# EAGLE schematic DCFilter (EAGLE 7.3.0)
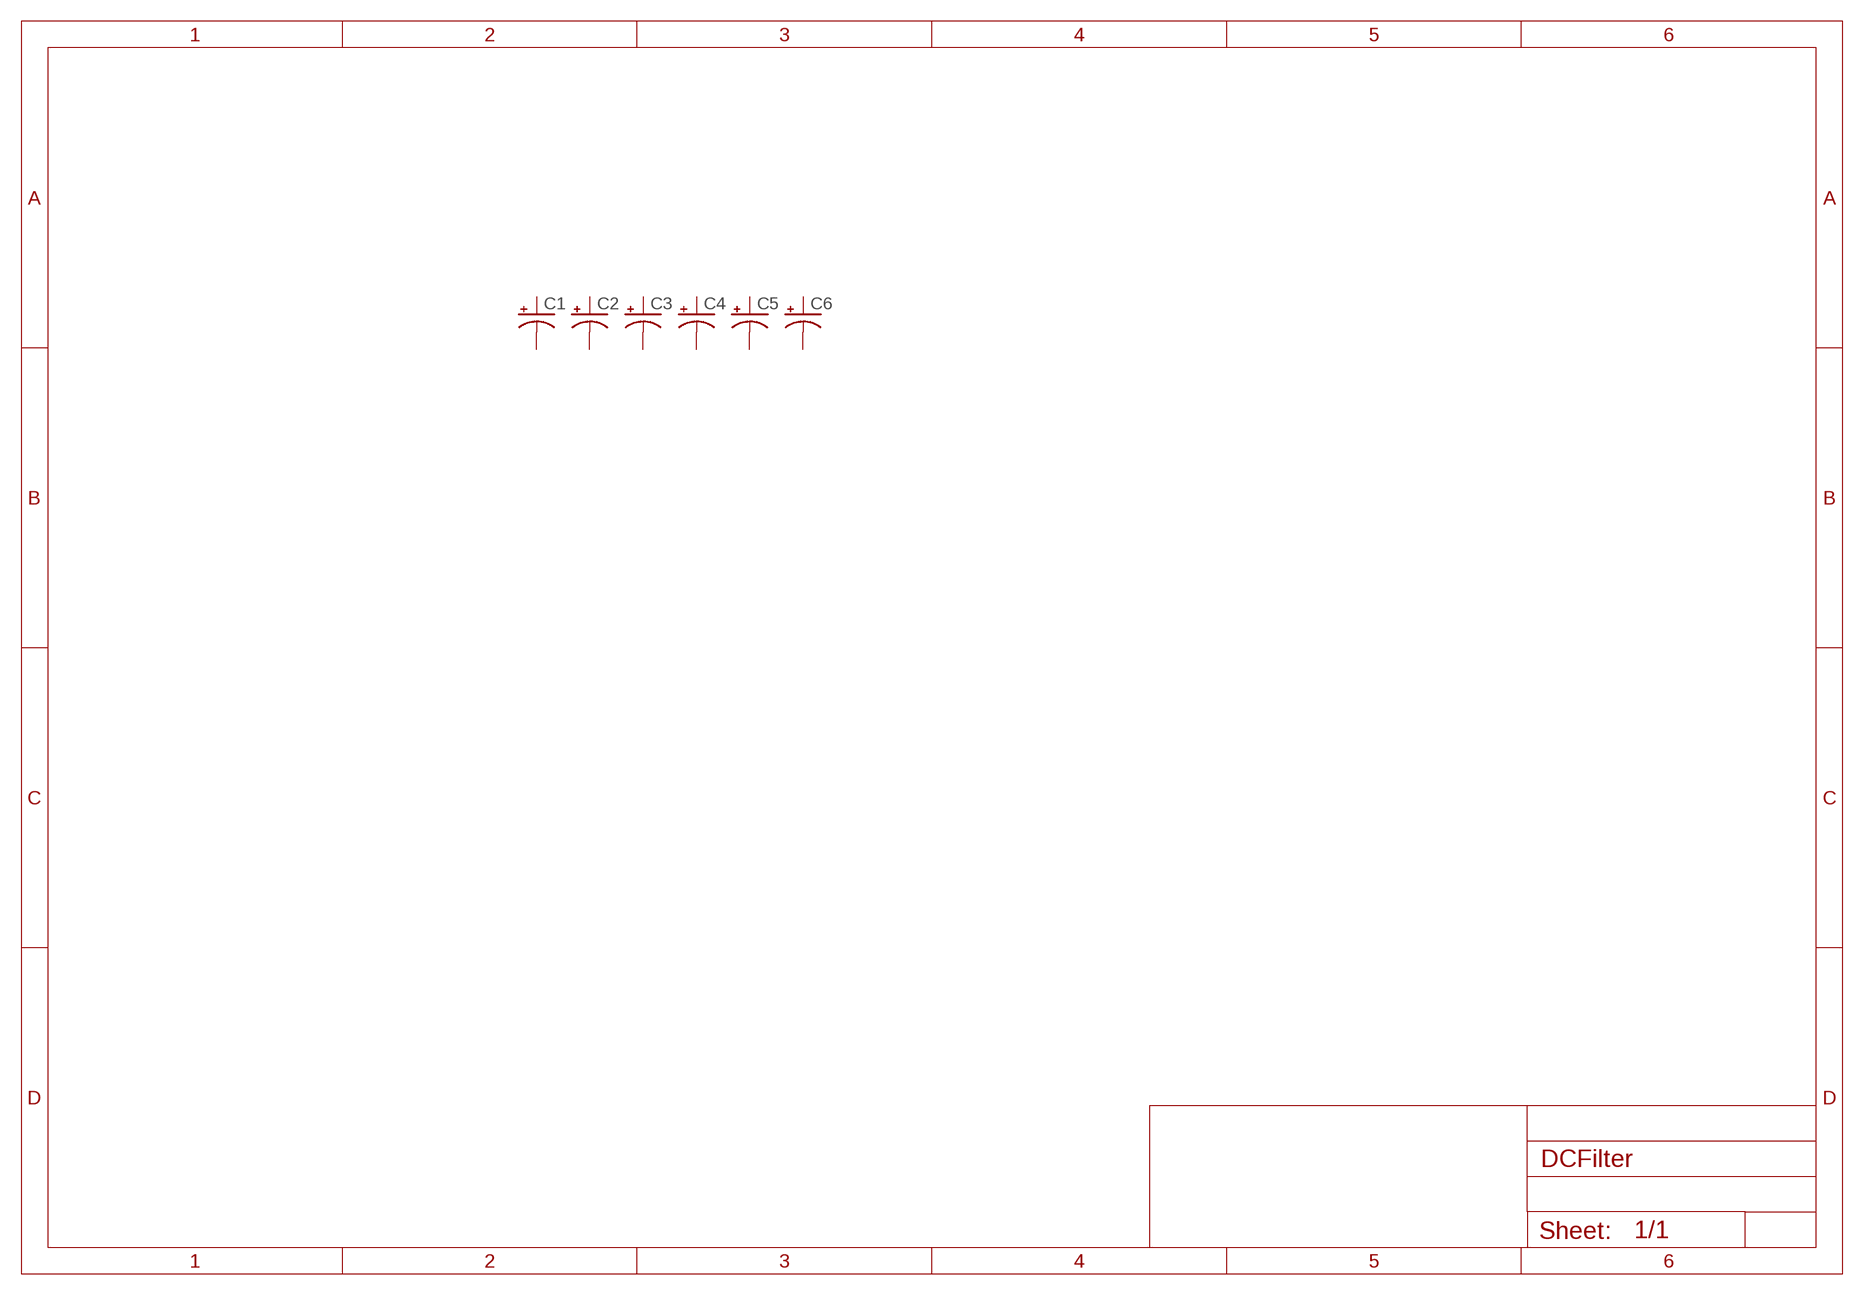
[diagram p0: schematic, sheet 1]

## Parts
C1  CPOL-USE10-22.5  [EB22,5D]
C2  CPOL-USE10-22.5  [EB22,5D]
C3  CPOL-USE10-22.5  [EB22,5D]
C4  CPOL-USE10-22.5  [EB22,5D]
C5  CPOL-USE10-22.5  [EB22,5D]
C6  CPOL-USE10-22.5  [EB22,5D]
Unconnected: C1.+ C1.- C2.+ C2.- C3.+ C3.- C4.+ C4.- C5.+ C5.- C6.+ C6.-

## Library data of the parts
C1-C6 = rcl:CPOL-US: POLARIZED CAPACITOR, American symbol